# EAGLE design 4mb (EAGLE 9.4.2)
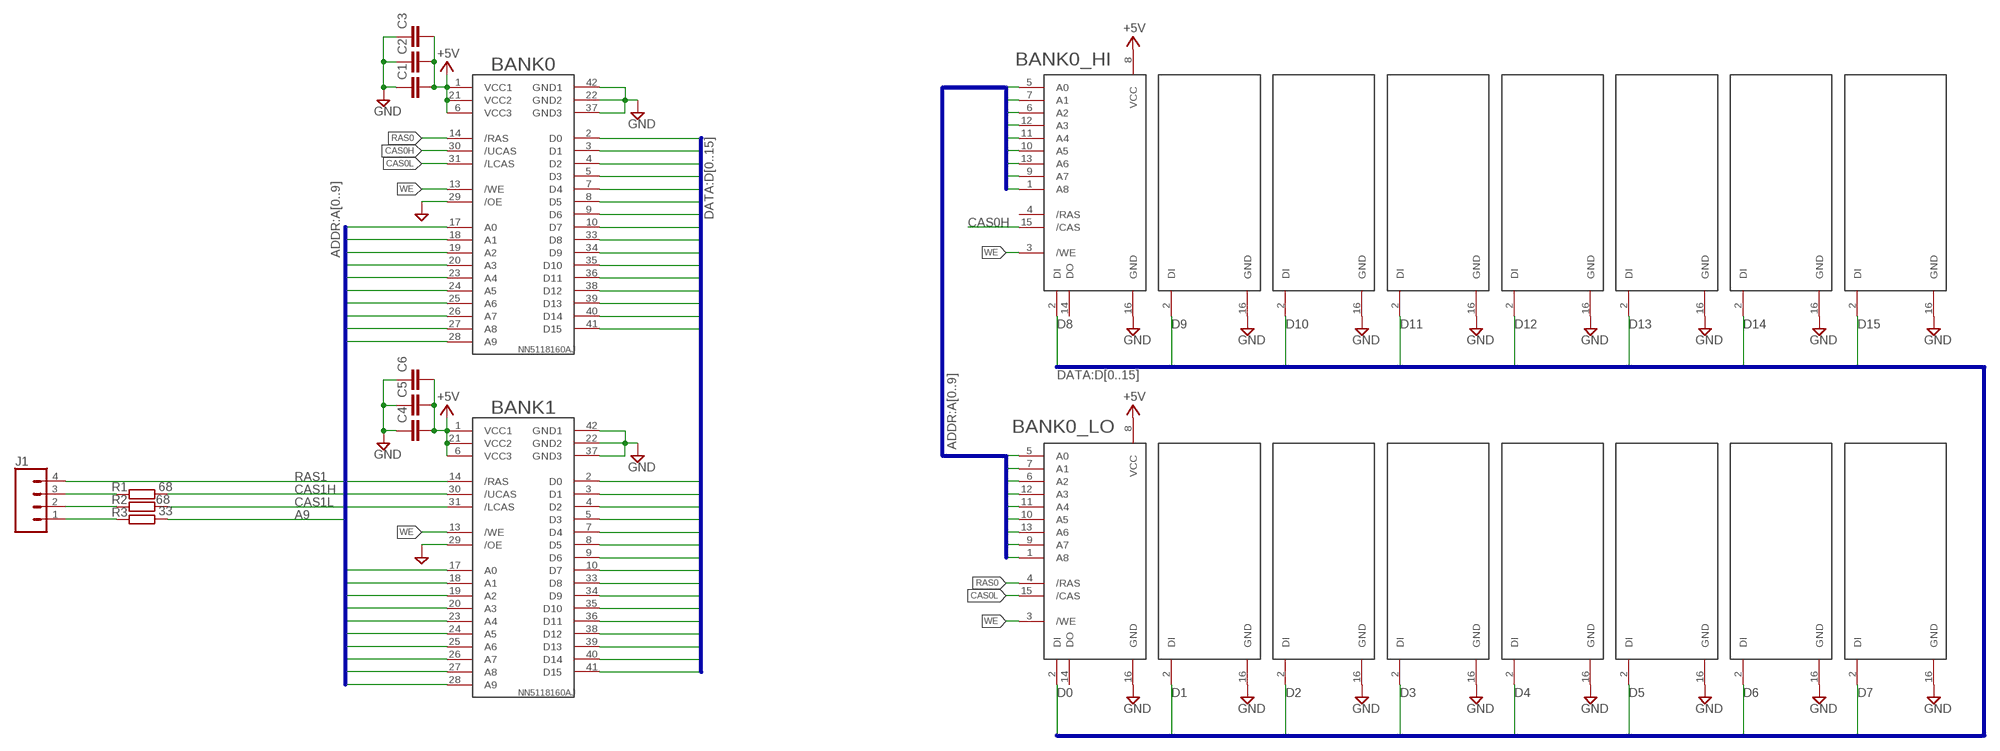
[diagram p0: schematic, sheet 1]

## Parts
C1  C-EUC0805  [C0805]
C2  C-EUC0805  [C0805]
C3  C-EUC0805  [C0805]
C4  C-EUC0805  [C0805]
C5  C-EUC0805  [C0805]
C6  C-EUC0805  [C0805]
J1  CONN_04PTH  [1X04]
R1  68  R-EU_R0805  [R0805]
R2  68  R-EU_R0805  [R0805]
R3  33  R-EU_R0805  [R0805]
U$1  NN5118160AJ  [SOJ127P1117X376-42]
U$2  NN5118160AJ  [SOJ127P1117X376-42]
U$3  ST_DRAM  [DIL16]
U$4  ST_DRAM_D  [ST_DRAM_SOCKET_MINIMAL]
U$5  ST_DRAM_D  [ST_DRAM_SOCKET_MINIMAL]
U$6  ST_DRAM_D  [ST_DRAM_SOCKET_MINIMAL]
U$7  ST_DRAM_D  [ST_DRAM_SOCKET_MINIMAL]
U$8  ST_DRAM_D  [ST_DRAM_SOCKET_MINIMAL]
U$9  ST_DRAM_D  [ST_DRAM_SOCKET_MINIMAL]
U$10  ST_DRAM_D  [ST_DRAM_SOCKET_MINIMAL]
U$11  ST_DRAM  [DIL16]
U$12  ST_DRAM_D  [ST_DRAM_SOCKET_MINIMAL]
U$13  ST_DRAM_D  [ST_DRAM_SOCKET_MINIMAL]
U$14  ST_DRAM_D  [ST_DRAM_SOCKET_MINIMAL]
U$15  ST_DRAM_D  [ST_DRAM_SOCKET_MINIMAL]
U$16  ST_DRAM_D  [ST_DRAM_SOCKET_MINIMAL]
U$17  ST_DRAM_D  [ST_DRAM_SOCKET_MINIMAL]
U$18  ST_DRAM_D  [ST_DRAM_SOCKET_MINIMAL]

## Nets
+5V: C1.2 C2.2 C3.2 C4.2 C5.2 C6.2 U$1.1(VCC1) U$1.6(VCC3) U$1.21(VCC2) U$2.1(VCC1) U$2.6(VCC3) U$2.21(VCC2) U$3.8(VCC) U$11.8(VCC)
A0: U$1.17(A0) U$2.17(A0) U$3.5(A0) U$11.5(A0)
A1: U$1.18(A1) U$2.18(A1) U$3.7(A1) U$11.7(A1)
A2: U$1.19(A2) U$2.19(A2) U$3.6(A2) U$11.6(A2)
A3: U$1.20(A3) U$2.20(A3) U$3.12(A3) U$11.12(A3)
A4: U$1.23(A4) U$2.23(A4) U$3.11(A4) U$11.11(A4)
A5: U$1.24(A5) U$2.24(A5) U$3.10(A5) U$11.10(A5)
A6: U$1.25(A6) U$2.25(A6) U$3.13(A6) U$11.13(A6)
A7: U$1.26(A7) U$2.26(A7) U$3.9(A7) U$11.9(A7)
A8: U$1.27(A8) U$2.27(A8) U$3.1(A8) U$11.1(A8)
A9: R3.2 U$1.28(A9) U$2.28(A9)
CAS0H: U$1.30(/UCAS) U$3.15(/CAS)
CAS0L: U$1.31(/LCAS) U$11.15(/CAS)
CAS1H: R1.2 U$2.30(/UCAS)
CAS1L: R2.2 U$2.31(/LCAS)
D0: U$1.2(D0) U$2.2(D0) U$11.2(DI)
D1: U$1.3(D1) U$2.3(D1) U$12.2(DI)
D2: U$1.4(D2) U$2.4(D2) U$13.2(DI)
D3: U$1.5(D3) U$2.5(D3) U$14.2(DI)
D4: U$1.7(D4) U$2.7(D4) U$15.2(DI)
D5: U$1.8(D5) U$2.8(D5) U$16.2(DI)
D6: U$1.9(D6) U$2.9(D6) U$17.2(DI)
D7: U$1.10(D7) U$2.10(D7) U$18.2(DI)
D8: U$1.33(D8) U$2.33(D8) U$3.2(DI)
D9: U$1.34(D9) U$2.34(D9) U$4.2(DI)
D10: U$1.35(D10) U$2.35(D10) U$5.2(DI)
D11: U$1.36(D11) U$2.36(D11) U$6.2(DI)
D12: U$1.38(D12) U$2.38(D12) U$7.2(DI)
D13: U$1.39(D13) U$2.39(D13) U$8.2(DI)
D14: U$1.40(D14) U$2.40(D14) U$9.2(DI)
D15: U$1.41(D15) U$2.41(D15) U$10.2(DI)
GND: C1.1 C2.1 C3.1 C4.1 C5.1 C6.1 U$1.22(GND2) U$1.29(/OE) U$1.37(GND3) U$1.42(GND1) U$2.22(GND2) U$2.29(/OE) U$2.37(GND3) U$2.42(GND1) U$3.16(GND) U$4.16(GND) U$5.16(GND) U$6.16(GND) U$7.16(GND) U$8.16(GND) U$9.16(GND) U$10.16(GND) U$11.16(GND) U$12.16(GND) U$13.16(GND) U$14.16(GND) U$15.16(GND) U$16.16(GND) U$17.16(GND) U$18.16(GND)
N$1: J1.2 R2.1
N$2: J1.1 R3.1
N$3: J1.3 R1.1
RAS0: U$1.14(/RAS) U$11.4(/RAS)
RAS1: J1.4 U$2.14(/RAS)
WE: U$1.13(/WE) U$2.13(/WE) U$3.3(/WE) U$11.3(/WE)
Unconnected: U$3.4(/RAS) U$3.14(DO) U$11.14(DO)

## Buses
ADDR:A[0..9]
DATA:D[0..15]

## Notes on the sheet
- BANK0_HI
- BANK0
- BANK1
- BANK0_LO

## Library data of the parts
C1-C6 = rcl:C-EU: CAPACITOR, European symbol; SPICEPREFIX: C
J1 = SparkFun-Connectors:CONN_04: Multi connection point. Often used as Generic Header-pin footprint for 0.1 inch spaced/style header connections On any of the 0.1 inch spaced packages, you can populate with these: Break Away Headers - Straight <https://www.sparkfun.com/products/116> (PRT-00116) Break Away Male Headers - Right Angle <https://www.sparkfun.com/products/553> (PRT-00553) Female Headers <https://www.sparkfun.com/products/115> (PRT-00115) Break Away Headers - Machine Pin <https://www.sparkfun.com/products/117> (PRT-00117) Break Away Female Headers - Swiss Machine Pin <https://www.sparkfun.com/products/743> (PRT-00743) For SCREWTERMINALS and SPRING TERMINALS visit here: Screw Terimnals on SparkFun.com <https://www.sparkfun.com/search/results?term=Screw+Terminals> (5mm/3.5mm/2.54mm spacing) This device is also useful as a general connection point to wire up your design to another part of your project. Our various solder wires solder well into these plated through hole pads. Hook-Up Wire - Assortment (Stranded, 22 AWG) <https://www.sparkfun.com/products/11375> (PRT-11375) Hook-Up Wire - Assortment (Solid Core, 22 AWG) <https://www.sparkfun.com/products/11367> (PRT-11367) View the entire wire category on our website here <https://www.sparkfun.com/categories/141> Special notes: Molex polarized connector foot print use with SKU : PRT-08231 with associated crimp pins and housings. 1MM SMD Version SKU: PRT-10208; PROD_ID: CONN-09696
R1-R3 = rcl:R-EU_: RESISTOR, European symbol; SPICEPREFIX: R
U$1 U$2 = AtariST:NN5118160AJ
U$3 U$11 = AtariST:ST_DRAM
U$4-U$10 U$12-U$18 = AtariST:ST_DRAM_D

## Board
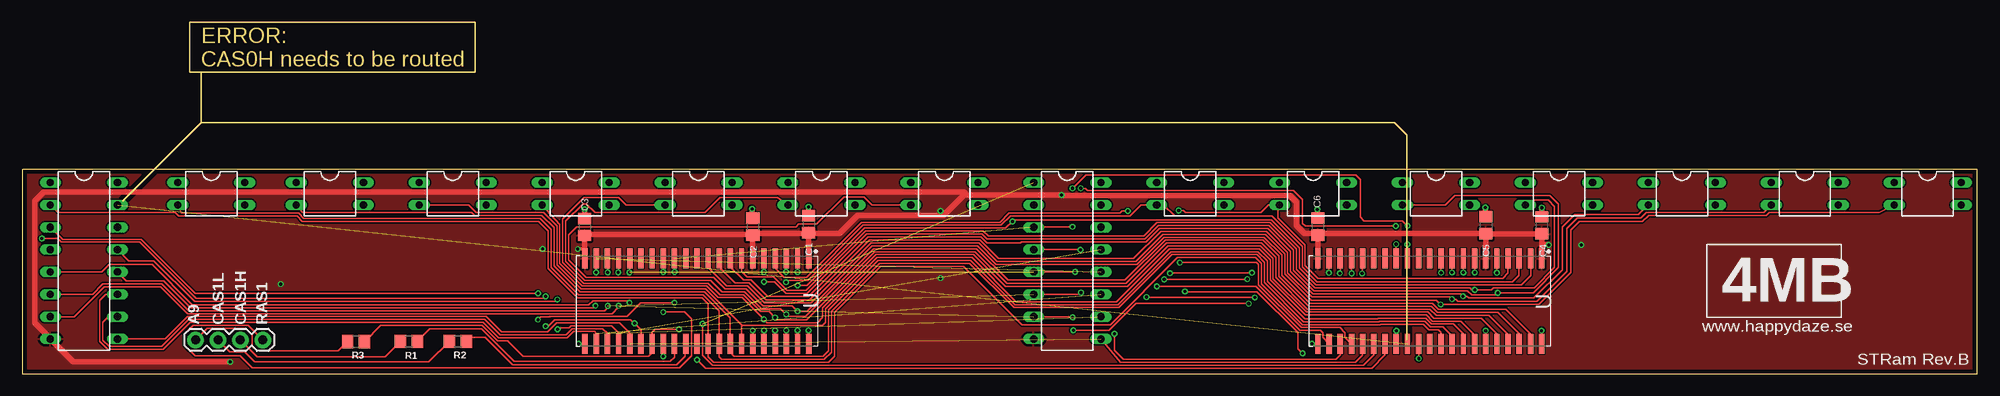
[diagram p1: board, top side]
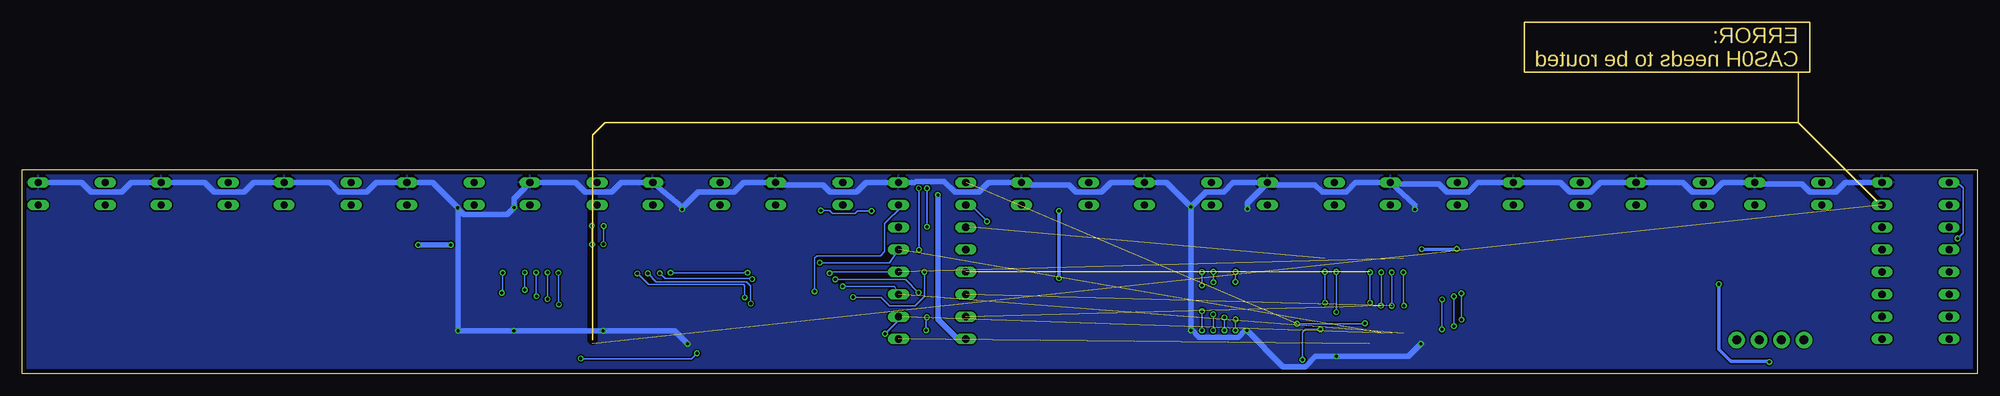
[diagram p2: board, bottom side, seen from below]

Size 222.01 x 39.98 mm. Coordinates in mm from the lower left corner, seen from the top.
Outline: 20.32,34.26 20.32,28.55
Outline: 20.32,28.55 11.43,19.66
Outline: 20.32,28.55 155.83,28.55 157.25,27.13 157.25,3.84
Outline: 20.32,34.26 19.05,34.26 19.05,39.98 51.44,39.98 51.44,34.26 20.32,34.26
Outline: 0,0 222.01,0 222.01,23.21 0,23.21 0,0
Copper layers (1*16): Top 0.035mm / dielectric 1.6mm / Bottom 0.035mm
Design rules "Elecrow_2-layer_PCB_eagle_rule *": minimum track width 7mil, minimum drill 12mil, track to track 6mil, track to pad 6mil, pad to pad 6mil, via to via 8mil, smd to smd 0mil, copper to edge 20mil, drill to drill 10mil, minimum pad ring 6mil, minimum via ring 6mil, stop-mask expansion 0mil, vias tented up to drill 100mil, thermal gap 10mil

### Footprints (pad centres in the part's own frame; a part is rotated, then mirrored left to right if it is on the bottom)
C0805 = smd 1.3 x 1.5: 1 -0.95,0; 2 0.95,0
1X04 = drill 1.016 pad 1.88: 1 0,0; 2 2.54,0; 3 5.08,0; 4 7.62,0
R0805 = smd 1.3 x 1.5: 1 -0.95,0; 2 0.95,0
SOJ127P1117X376-42 = smd 2.315 x 0.612: 1 -4.854,12.7; 2 -4.854,11.43; 3 -4.854,10.16; 4 -4.854,8.89; 5 -4.854,7.62; 6 -4.854,6.35; 7 -4.854,5.08; 8 -4.854,3.81; 9 -4.854,2.54; 10 -4.854,1.27; 11 -4.854,0; 12 -4.854,-1.27; 13 -4.854,-2.54; 14 -4.854,-3.81; 15 -4.854,-5.08; 16 -4.854,-6.35; 17 -4.854,-7.62; 18 -4.854,-8.89; 19 -4.854,-10.16; 20 -4.854,-11.43; 21 -4.854,-12.7; 22 4.854,-12.7; 23 4.854,-11.43; 24 4.854,-10.16; 25 4.854,-8.89; 26 4.854,-7.62; 27 4.854,-6.35; 28 4.854,-5.08; 29 4.854,-3.81; 30 4.854,-2.54; 31 4.854,-1.27; 32 4.854,0; 33 4.854,1.27; 34 4.854,2.54; 35 4.854,3.81; 36 4.854,5.08; 37 4.854,6.35; 38 4.854,7.62; 39 4.854,8.89; 40 4.854,10.16; 41 4.854,11.43; 42 4.854,12.7
DIL16 = drill 0.813 long: 1 0,0; 2 0,-2.54; 3 0,-5.08; 4 0,-7.62; 5 0,-10.16; 6 0,-12.7; 7 0,-15.24; 8 0,-17.78; 9 7.62,-17.78; 10 7.62,-15.24; 11 7.62,-12.7; 12 7.62,-10.16; 13 7.62,-7.62; 14 7.62,-5.08; 15 7.62,-2.54; 16 7.62,0
ST_DRAM_SOCKET_MINIMAL = drill 0.813 long: 1 0,0; 2 0,-2.54; 15 7.62,-2.54; 16 7.62,0

### Placement (x,y rotation side)
C1  89.31,16.99 270 top
C2  82.96,16.73 270 top
C3  63.88,16.67 270 top
C4  172.54,16.87 270 top
C5  166.19,16.89 270 top
C6  147.12,16.72 270 top
J1  19.71,3.86 0 top
R1  43.92,3.68 0 top
R2  49.48,3.68 0 top
R3  37.92,3.66 0 top
U$1  159.82,8.26 270 top
U$2  76.62,8.26 270 top
U$3  3.22,21.73 0 top
U$4  17.67,21.73 0 top
U$5  31.13,21.73 0 top
U$6  45.09,21.73 0 top
U$7  59.04,21.73 0 top
U$8  73,21.73 0 top
U$9  86.95,21.73 0 top
U$10  100.91,21.73 0 top
U$11  114.86,21.73 0 top
U$12  128.82,21.73 0 top
U$13  142.77,21.73 0 top
U$14  156.73,21.73 0 top
U$15  170.68,21.73 0 top
U$16  184.64,21.73 0 top
U$17  198.59,21.73 0 top
U$18  212.55,21.73 0 top

### Tracks (layer width: path | path; a pad name or v marks a point on that pad's centre or on a via)
+5V  (via drill 0.35)
  Top 0.406: 63.88,14.11 63.82,14.17 v63.09,14.17
  Top 0.61: U$1.6 166.18,15.92 C5.2 | C5.2 166.21,15.92 C4.2 172.53,15.9 172.53,14.68 | C5.2 147.28,15.94 | 147.28,15.94 C6.2 147.12,13.12 U$1.21 | U$2.6 82.97,15.84 82.96,15.83 C2.2 | U$2.1 89.31,13.12 89.31,15.93 | U$2.21 63.88,13.14 63.88,14.11 C3.2 63.88,15.85 82.88,15.85 C2.2 | 89.31,15.93 83.11,15.93 C2.2 | 89.31,15.93 89.31,15.95 | 89.31,15.95 C1.2 | 89.31,15.95 92.83,15.95 94.85,17.97 104.59,17.97 106.93,20.31 | 147.28,15.94 145.61,15.94 144.69,16.86 144.69,19.53 143.93,20.28 118.06,20.28 v118.03,20.31 106.93,20.31 | 106.93,20.31 107.12,20.5 106.96,20.66 2.45,20.66 1.45,19.66 1.45,5.78 3.22,4 U$3.8 5.83,1.35 v23.65,1.35 | U$1.1 172.53,14.68 | v173.33,14.66 173.3,14.68 172.53,14.68
  Bottom 0.406: v104.29,18.49 v104.29,10.87 | v23.65,1.35 23.7,1.4 27.99,1.4 27.99,1.42 29.36,2.79 v29.36,10.19 | v63.09,14.17 63.07,14.15 59.16,14.15 v59.11,14.2
  Bottom 0.61: U$11.8 115.79,3.95 118.03,6.2 v118.03,20.31 | v173.33,14.66 v177.04,14.66
  pour Top: 0.15,22.94 221.77,22.94 221.77,0.08 0.15,0.08
A0  (via drill 0.35)  (1 unrouted)
  Top 0.178: U$2.17 69,11.56 v68.96,11.53 | v68.96,8.08 68.73,8.31 64.81,8.31 64.35,7.84 19.34,7.84 14.76,12.42 9.88,12.42 9.03,11.57 U$3.5 | U$1.17 152.21,11.45 v152.15,11.39 | v139.95,8.66 127.71,8.66 v127.66,8.71 | v119.57,11.57 U$11.5
  Bottom 0.178: v68.96,11.53 v68.96,8.08 | v152.15,11.39 150.89,10.13 140.1,10.13 139.95,9.98 v139.95,8.66 | v127.66,8.71 124.48,8.71 123.52,7.75 120.6,7.75 119.56,8.79 v119.56,11.57 v119.57,11.57
A1  (via drill 0.35)  (1 unrouted)
  Top 0.178: U$11.7 119.21,6.49 v119.28,6.43 | U$2.18 67.72,11.56 v67.69,11.53 | v67.72,7.74 67.72,7.58 66.96,6.83 18.8,6.83 15.74,9.88 9.32,9.88 5.93,6.49 U$3.7 | U$1.18 150.94,11.42 v150.95,11.4 | v139.27,7.98 126.46,7.98 123.42,4.94 119.37,4.94 v119.36,4.95
  Bottom 0.178: v67.69,11.53 67.69,7.76 v67.72,7.74 | v150.95,11.4 150.01,10.46 139.72,10.46 139.27,10.01 v139.27,7.98 | v119.36,4.95 119.36,6.35 v119.28,6.43
A2  (via drill 0.35)  (1 unrouted)
  Top 0.178: U$11.6 120.03,9.03 v120.22,9.22 120.24,9.19 | U$2.19 66.45,11.57 v66.5,11.53 | v66.5,7.71 66.5,7.54 66.12,7.17 18.93,7.17 15.88,10.21 9.19,10.21 8.01,9.03 U$3.6 | U$1.19 149.66,11.49 v149.61,11.43 | v139.1,10.76 139.06,10.72 v129.67,10.72
  Bottom 0.178: v66.5,11.53 v66.5,7.71 | v149.61,11.43 149,10.82 139.16,10.82 v139.1,10.76 | v129.67,10.72 129.66,10.71 121.71,10.71 v120.22,9.22
A3  (via drill 0.35)  (1 unrouted)
  Top 0.178: U$2.20 v65.19,11.54 v65.18,11.53 | v65.1,7.74 64.88,7.51 19.13,7.51 16.09,10.56 11.86,10.56 U$3.12 | U$1.20 v148.4,11.49 v148.39,11.48 | v130.33,11.43 130.38,11.48 v139.65,11.48
  Bottom 0.178: v65.18,11.53 65.15,11.5 65.15,7.79 v65.1,7.74 | v148.39,11.48 v139.65,11.48 | U$11.12 130.19,11.57 v130.33,11.43
A4  (via drill 0.35)  (1 unrouted)
  Top 0.178: U$2.23 65.19,4.61 65,4.8 62.6,4.8 61.9,4.09 54.12,4.09 52.38,5.84 19.09,5.84 16.02,2.77 9.73,2.77 8.8,3.7 8.8,8.32 9.51,9.03 U$3.11 | U$1.23 147.67,4.12 147.67,4.66 147.4,4.93 145.1,4.93 140.09,9.93 v128.83,9.93
  Bottom 0.178: v128.83,9.93 122.94,9.93 U$11.11
A5  (via drill 0.35)  (1 unrouted)
  Top 0.178: U$2.24 66.45,4.59 65.91,5.13 62.47,5.13 61.76,4.43 54.28,4.43 52.54,6.17 18.95,6.17 15.88,3.1 9.88,3.1 9.17,3.81 9.17,5.86 9.8,6.49 U$3.10 | U$1.24 149.68,3.39 149.68,2.14 149.19,1.65 125.04,1.65 124.03,2.67 v124.03,4.55
  Bottom 0.178: v124.03,4.55 122.08,6.49 U$11.10
A6  (via drill 0.35)  (1 unrouted)
  Top 0.178: U$2.25 67.75,3.43 67.75,4.66 66.95,5.46 62.33,5.46 62.12,5.25 61.01,5.25 v60.81,5.04 | U$3.13 12.14,12.82 14.97,12.82 19.58,8.2 60.78,8.2 v60.78,8.44 | U$1.25 150.21,4.12 150.21,4.66 149.61,5.26 145.23,5.26 140.39,10.11 140.39,12.41 140.16,12.63 131.45,12.63 v131.44,12.62
  Bottom 0.178: v60.78,8.44 60.81,8.41 v60.81,5.04 | v131.44,12.62 123.53,12.62 U$11.13
A7  (1 unrouted)
  Top 0.178: U$2.26 69.02,3.43 69.02,4.61 67.84,5.79 60.71,5.79 59.69,4.78 54.43,4.78 52.7,6.5 18.81,6.5 16.26,3.95 U$3.9 | U$1.26 152.21,2.13 151.38,1.31 124.69,1.31 U$11.9
A8  (via drill 0.35)  (1 unrouted)
  Top 0.178: U$2.27 70.27,5 v69.53,5.73 69.11,6.15 60.48,6.15 59.74,5.41 v59.44,5.41 | v59.44,8.79 59.21,8.56 19.77,8.56 13.37,14.96 4.46,14.96 4.04,15.39 2.28,15.39 v2.26,15.37 | U$1.27 153.47,2.16 152.3,0.98 78.38,0.98 77.27,2.09 v77.27,5.69
  Bottom 0.178: v59.44,8.79 v59.44,5.41 | v2.26,15.37 1.63,15.99 1.63,21.08 2.28,21.73 U$3.1 | v77.27,5.69 77.26,5.7 69.56,5.7 v69.53,5.73
A9  (via drill 0.35)
  Top 0.178: R3.2 40.73,5.51 52.24,5.51 53.98,3.76 55.1,3.76 56.89,1.98 71.14,1.98 71.53,2.37 U$2.28 71.53,4.7 71.89,5.05 v74.6,5.05 | U$1.28 154.75,2.15 153.24,0.65 77.58,0.65 v76.63,1.6
  Bottom 0.178: v76.63,1.6 76.63,4.72 76.3,5.05 v74.6,5.05
CAS0H  (1 unrouted)
CAS0L  (via drill 0.35)
  Top 0.178: U$1.31 158.57,3.39 v158.57,1.73 | v145.39,2.32 144.86,2.85 144.86,4.7 140.22,9.34 v132.04,9.34 v132.03,9.35
  Bottom 0.178: v158.57,1.73 145.98,1.73 v145.39,2.32 | v132.03,9.35 132.01,9.35 132.01,13.16 131.77,13.41 124.54,13.41 124.06,13.89 124.06,17.06 122.04,19.07 U$11.15
CAS1H
  Top 0.178: U$2.30 74.08,1.89 73.58,1.4 55.86,1.4 55.11,2.15 55.11,2.17 52.17,5.11 46.29,5.11 R1.2
CAS1L
  Top 0.178: U$2.31 75.26,3.32 75.26,2.01 74.3,1.04 55.7,1.04 52.6,4.14 50.89,4.14 R2.2
D0  (via drill 0.35)
  Top 0.178: U$1.2 171.32,13.04 171.32,11.2 170.23,10.11 146.92,10.11 145.01,12.02 145.01,14.33 141.83,17.5 112.63,17.5 v112.45,17.32 111.68,16.56 95.62,16.56 89.1,10.04 v88.04,10.04 | v88.04,11.56 88.04,13.1 U$2.2
  Bottom 0.178: v88.04,10.04 v88.04,11.56 | U$11.2 114.3,19.19 112.58,17.48 112.58,17.45 v112.45,17.32
D1  (via drill 0.35)
  Top 0.178: U$1.3 169.93,13.06 169.93,11.18 169.22,10.46 147.03,10.46 145.34,12.16 145.34,14.48 141.91,17.91 130.88,17.91 129.59,19.19 U$12.2 127.05,19.19 125.78,17.92 112.2,17.92 111.17,16.89 95.49,16.89 89.23,10.63 86.97,10.63 v86.74,10.4 | v86.74,11.58 86.74,13.08 U$2.3
  Bottom 0.178: v86.74,10.4 v86.74,11.58
D2  (via drill 0.35)
  Top 0.178: U$1.4 168.72,11.44 168.1,10.82 147.14,10.82 145.67,12.29 145.67,14.65 142.6,17.72 142.6,18.81 U$13.2 141.52,19.19 140.66,18.33 132.07,18.33 131.85,18.55 v131.32,18.55 | U$2.4 85.5,12.01 86.54,10.97 89.08,10.97 95.33,17.22 111.03,17.22 112.06,18.25 124.64,18.25 124.88,18.49 v125.55,18.49
  Bottom 0.178: v125.55,18.49 127.15,18.49 127.42,18.23 129.99,18.23 130.31,18.55 v131.32,18.55
D3  (via drill 0.35)
  Top 0.178: U$14.2 161.61,19.19 162.69,20.27 173.46,20.27 174.45,19.28 174.45,12.06 171.58,9.19 v167.54,9.19 167.28,8.94 164.59,8.94 164.11,9.42 146.67,9.42 144.35,11.75 144.35,14.05 141.56,16.84 129.01,16.84 127.49,15.32 109.57,15.32 109.02,15.87 95.87,15.87 89.14,9.14 86.73,9.14 85.44,10.43 v84.25,10.43 | v167.44,11.48 U$1.5 | v84.23,11.58 84.23,13.1 U$2.5
  Bottom 0.178: v167.44,11.48 167.44,9.3 v167.54,9.19 | v84.25,10.43 84.23,10.45 v84.23,11.58
D4  (via drill 0.35)
  Top 0.178: U$15.2 171.16,19.19 171.7,19.74 173.27,19.74 173.99,19.02 173.99,12.09 171.68,9.78 167.06,9.78 166.8,9.52 v164.92,9.52 164.63,9.52 164.37,9.78 146.78,9.78 144.68,11.88 144.68,14.19 141.7,17.17 128.88,17.17 127.35,15.65 109.71,15.65 109.13,16.23 95.76,16.23 89,9.47 86.87,9.47 85.34,11 82.3,11 81.69,11.61 81.69,13.1 U$2.7 | v164.92,11.51 164.92,13.09 U$1.7
  Bottom 0.178: v164.92,11.51 v164.92,9.52
D5  (via drill 0.35)
  Top 0.178: U$16.2 183.53,18.08 176.3,18.08 174.88,16.66 174.88,11.83 171.66,8.61 164.25,8.61 164.05,8.81 v163.6,8.81 163.35,9.06 146.56,9.06 144.02,11.61 144.02,13.92 141.42,16.51 129.15,16.51 127.6,14.96 113.46,14.96 113.36,14.87 109.56,14.87 108.88,15.54 96.06,15.54 89.31,8.79 84.63,8.79 82.78,10.64 81.92,10.64 80.39,12.17 80.39,13.08 U$2.8 | U$1.8 v163.63,11.51
  Bottom 0.178: v163.63,11.51 163.63,8.84 v163.6,8.81
D6  (via drill 0.35)
  Top 0.178: U$17.2 197.73,18.33 184.38,18.33 183.76,17.7 176.56,17.7 175.36,16.51 175.36,11.66 172.48,8.72 172,8.25 163.03,8.25 162.79,8.48 v162.36,8.48 162.11,8.73 146.43,8.73 143.69,11.47 143.69,13.78 141.29,16.18 129.29,16.18 126.21,13.11 110.85,13.11 108.77,15.19 96.2,15.19 89.4,8.39 84.46,8.39 82.54,10.31 80.97,10.31 79.16,12.13 U$2.9 | v162.36,11.51 U$1.9
  Bottom 0.178: v162.36,11.51 v162.36,8.48
D7  (via drill 0.35)
  Top 0.178: U$18.2 210.83,18.3 198.36,18.3 198.06,18 184.67,18 183.99,17.31 176.8,17.31 175.84,16.36 175.84,11.51 172.21,7.87 v161.06,7.87 160.6,8.33 146.36,8.33 143.36,11.34 143.36,13.64 141.15,15.85 129.52,15.85 126.45,12.78 110.71,12.78 108.63,14.86 96.39,14.86 89.58,8.06 84.28,8.06 82.35,9.98 79.98,9.98 77.88,12.09 77.88,13.1 U$2.10 | v161.11,11.48 161.09,11.5 U$1.10
  Bottom 0.178: v161.11,11.48 161.11,7.92 v161.06,7.87
D8
  Top 0.178: U$1.33 161.09,4.72 160.82,4.99 159.74,4.99 159.11,5.62 154.23,5.62 154.2,5.59 145.37,5.59 140.72,10.24 140.72,12.55 140.06,13.21 131.19,13.21 123.57,5.59 113.51,5.59 106.88,12.22 97.48,12.22 92.23,6.97 92.23,1.98 91.55,1.31 78.51,1.31 77.89,1.93 U$2.33 77.89,7.95 77.19,8.65 63.06,8.65 59.74,11.97 59.74,16.23 58.65,17.32 31.8,17.32 31.21,17.91 17.76,17.91 17.37,18.3 4.11,18.3 U$3.2
D9
  Top 0.178: U$1.34 162.37,4.28 161.32,5.32 159.87,5.32 159.25,5.95 154.09,5.95 154.06,5.92 145.51,5.92 141.05,10.38 141.05,12.68 140.19,13.54 130.56,13.54 124.55,7.52 112.6,7.52 107.58,12.55 97.34,12.55 91.9,7.1 91.9,2.46 91.07,1.64 79.44,1.64 79.12,1.96 79.12,3.37 U$2.34 79.16,7.15 77.33,8.98 63.2,8.98 60.07,12.11 60.07,16.42 58.84,17.65 32,17.65 31.4,18.25 18.06,18.25 U$4.2
D10
  Top 0.178: U$1.35 163.63,4.51 162.49,5.65 160.01,5.65 159.39,6.28 153.95,6.28 153.92,6.25 145.64,6.25 141.38,10.52 141.38,12.82 140.33,13.87 130.43,13.87 124.41,7.85 112.74,7.85 107.71,12.88 97.21,12.88 91.57,7.24 91.57,2.6 90.97,2 80.85,2 80.37,2.49 80.37,3.34 U$2.35 80.41,3.41 80.41,6.36 77.47,9.31 63.34,9.31 60.4,12.24 60.4,16.61 59,18.01 51.36,18.01 51.03,18.34 31.87,18.34 U$5.2
D11
  Top 0.178: U$1.36 164.91,4.44 163.36,5.98 160.15,5.98 159.45,6.68 145.68,6.68 141.71,10.65 141.71,12.96 140.47,14.2 130.29,14.2 124.27,8.18 112.88,8.18 107.85,13.21 97.07,13.21 91.24,7.38 91.24,5.84 90.88,5.49 81.79,5.49 | U$2.36 81.69,5.39 81.79,5.49 | 81.79,5.49 81.75,5.49 77.6,9.64 63.48,9.64 60.73,12.38 60.73,16.82 59.21,18.34 51.58,18.34 50.73,19.19 U$6.2
D12  (via drill 0.35)
  Top 0.178: U$1.38 167.44,4.56 165.69,6.31 160.28,6.31 159.59,7.01 145.81,7.01 142.04,10.79 142.04,13.09 140.6,14.53 130.12,14.53 125.5,9.91 111.66,9.91 108.03,13.54 96.93,13.54 90.91,7.51 90.91,6.4 90.32,5.82 84.58,5.82 v84.23,6.17 81.74,8.66 79.05,8.66 77.74,9.97 63.61,9.97 61.06,12.52 61.06,16.95 U$7.2 | v84.25,4.92 84.23,4.9 U$2.38
  Bottom 0.178: v84.23,6.17 84.23,4.94 v84.25,4.92
D13  (via drill 0.35)
  Top 0.178: U$1.39 168.72,4.49 166.56,6.64 160.55,6.64 159.86,7.34 145.95,7.34 142.37,10.93 142.37,13.23 140.74,14.86 129.96,14.86 125.36,10.26 111.8,10.26 108.19,13.87 96.8,13.87 89.08,6.16 85.72,6.16 v85.5,6.39 84.81,7.07 83.84,7.07 81.91,8.99 79.22,8.99 77.92,10.3 63.75,10.3 61.39,12.65 61.39,17.6 63.83,20.04 67.73,20.04 68.58,19.19 U$8.2 | v85.5,4.92 v85.5,4.91 U$2.39
  Bottom 0.178: v85.5,6.39 v85.5,4.92
D14  (via drill 0.35)
  Top 0.178: U$1.40 169.99,4.56 167.57,6.97 160.69,6.97 159.99,7.67 146.09,7.67 142.7,11.06 142.7,13.37 140.88,15.19 129.79,15.19 125.25,10.64 111.91,10.64 108.36,14.2 96.66,14.2 88.98,6.52 87,6.52 v86.77,6.75 86.12,7.4 83.97,7.4 82.05,9.32 79.5,9.32 78.2,10.63 63.89,10.63 61.72,12.79 61.72,17.34 63.7,19.31 64.07,19.31 65.04,18.34 77.52,18.34 79.22,20.04 85.77,20.04 U$9.2 | v86.77,4.92 86.77,3.41 U$2.40
  Bottom 0.178: v86.77,6.75 v86.77,4.92
D15  (via drill 0.35)
  Top 0.178: U$1.41 171.25,4.54 168.49,7.31 160.83,7.31 160.13,8 146.23,8 143.03,11.2 143.03,13.5 141.01,15.52 129.66,15.52 126.56,12.42 110.6,12.42 108.49,14.53 96.52,14.53 89.11,7.11 v88.04,7.11 87.42,7.73 84.11,7.73 82.19,9.65 79.82,9.65 78.51,10.96 64.02,10.96 62.05,12.93 62.05,15.76 62.97,16.68 87.87,16.68 88.19,17 90.19,17 93.31,20.12 95.58,20.12 96.5,19.19 U$10.2 | v88.04,4.92 v88.05,4.91 U$2.41
  Bottom 0.178: v88.04,7.11 v88.04,4.92
GND  (via drill 0.35)
  Top 0.178: U$2.42 v89.31,4.91 v89.31,4.92 | U$1.42 v172.53,4.89 v172.52,4.9 | U$1.37 v166.18,4.89 v166.17,4.9 | U$1.29 156.01,4.86 v156.03,4.88 | U$1.22 v146.43,3.4 | U$2.37 v82.97,4.91 v82.96,4.92 | U$2.22 v63.2,3.4 | U$2.29 v72.81,1.97 v72.8,1.97
  Top 0.61: C3.1 v63.88,18.69 | C2.1 82.88,17.75 v82.88,18.75 | C1.1 v89.31,18.97 | C6.1 147.07,17.73 v147.07,18.69 | C5.1 166.14,17.89 v166.14,18.9 | C4.1 v172.54,18.87
  Bottom 0.61: v172.54,18.87 172.54,18.81 171.86,18.13 166.91,18.13 v166.14,18.9 166.14,19.94 U$14.16 159.15,21.73 158.09,20.67 155.07,20.67 154,21.73 U$13.16 147.07,18.96 v147.07,18.69 147.07,18.83 145.23,20.67 141.17,20.67 140.1,21.73 U$12.16 136.18,21.48 131.07,21.48 130.26,20.67 127.27,20.67 126.2,21.73 U$11.16 120.65,21.73 120.52,21.87 117.31,21.87 116.11,20.67 113.37,20.67 112.3,21.73 U$10.16 108.25,21.45 103.12,21.45 102.33,20.67 99.47,20.67 98.4,21.73 U$9.16 92.06,21.73 v89.31,18.97 | v172.54,18.87 175.4,21.73 U$15.16 181.8,21.73 182.87,20.67 186.04,20.67 187.11,21.73 U$16.16 195.7,21.73 196.77,20.67 200.19,20.67 201.26,21.73 U$17.16 209.6,21.73 210.67,20.67 214.17,20.67 215.24,21.73 U$18.16 | v89.31,18.97 87.61,20.67 85.57,20.67 84.5,21.73 U$8.16 | U$8.16 80.59,21.69 82.88,19.41 v82.88,18.75 | U$8.16 80.36,21.48 75.2,21.48 74.38,20.67 71.67,20.67 70.6,21.73 U$7.16 | U$7.16 66.51,21.58 61.17,21.58 60.25,20.67 57.77,20.67 56.7,21.73 U$6.16 47.37,21.73 46.3,20.67 43.87,20.67 42.8,21.73 U$5.16 33.45,21.73 32.38,20.67 29.97,20.67 28.9,21.73 U$4.16 25.11,21.55 19.95,21.55 19.06,20.67 16.07,20.67 15,21.73 U$3.16 | v63.88,18.69 63.88,19.17 U$7.16 | v172.54,18.87 172.52,18.85 v172.52,4.9 v166.17,4.9 156.06,4.9 v156.03,4.88 147.9,4.88 v146.43,3.4 | v89.31,18.97 v89.31,4.92 89.15,4.92 88.36,4.13 83.93,4.13 83.14,4.92 v82.96,4.92 78.85,0.82 76.31,0.82 75.16,1.97 v72.8,1.97 64.63,1.97 v63.2,3.4
  pour Bottom: 0.15,22.94 222.4,22.94 222.4,0.08 0.15,0.08
N$1
  Top 0.178: R2.1 46.19,1.35 26.44,1.35 25.27,2.51 23.59,2.51 J1.2
N$2
  Top 0.178: R3.1 35.91,2.6 26.69,2.6 26.15,3.14 26.15,4.41 25.4,5.16 21.01,5.16 J1.1
N$3
  Top 0.178: R1.1 42.97,3.67 41.22,1.93 26.72,1.93 J1.3
RAS0  (via drill 0.35)
  Top 0.178: U$11.4 120.13,14.11 v120.17,14.07 | v120.19,21.08 120.73,21.08 120.98,20.83 144.36,20.83 145.36,19.84 145.36,17.11 145.68,16.78 v155.98,16.78 v155.98,16.79 | v156.01,14.73 156.01,13.12 U$1.14
  Bottom 0.178: v120.19,21.08 120.19,14.07 v120.17,14.07 | v155.98,16.79 155.98,14.76 v156.01,14.73
RAS1  (via drill 0.35)
  Top 0.178: J1.4 25.69,5.49 19.44,5.49 18.49,4.53 18.49,3.17 19.63,2.03 24.75,2.03 26.12,0.66 74.64,0.66 75.99,2.02 75.99,6.23 75.21,7.01 v72.8,7.01 | v72.8,11.58 72.8,13.1 U$2.14
  Bottom 0.178: v72.8,11.58 v72.8,7.01
WE  (via drill 0.35)  (1 unrouted)
  Top 0.178: U$11.3 114.47,16.7 v119.26,16.7 | U$3.3 3.24,16.65 4.6,15.29 13.51,15.29 19.68,9.13 v58.58,9.13 | v58.57,6.15 58.9,6.48 59.84,6.48 | 60.04,6.48 59.84,6.48 | 59.84,6.48 59.87,6.5 68.67,6.5 70.23,8.06 74.05,8.06 v74.07,8.08 | v74.09,11.58 74.08,11.6 U$2.13 | v119.25,21.08 120.77,22.6 151.44,22.6 151.94,22.09 151.94,17.81 152.38,17.37 156.74,17.37 v157.3,16.81 | U$1.13 v157.28,14.7 v157.28,14.71
  Bottom 0.178: v58.57,6.15 v58.58,6.15 v58.58,9.13 | v74.07,8.08 74.07,11.56 v74.09,11.58 | v119.26,16.7 119.26,21.07 v119.25,21.08 | v157.28,14.71 157.28,16.79 v157.3,16.81

### Text on the board
Dimension: ERROR: / CAS0H needs to be routed
tPlace: U | U | A9 | CAS1L | CAS1H | RAS1
tNames: 4MB | www.happydaze.se | STRam Rev.B